# EAGLE design i2c-infrared-proximity-sensor-double-sided (EAGLE 5.11)
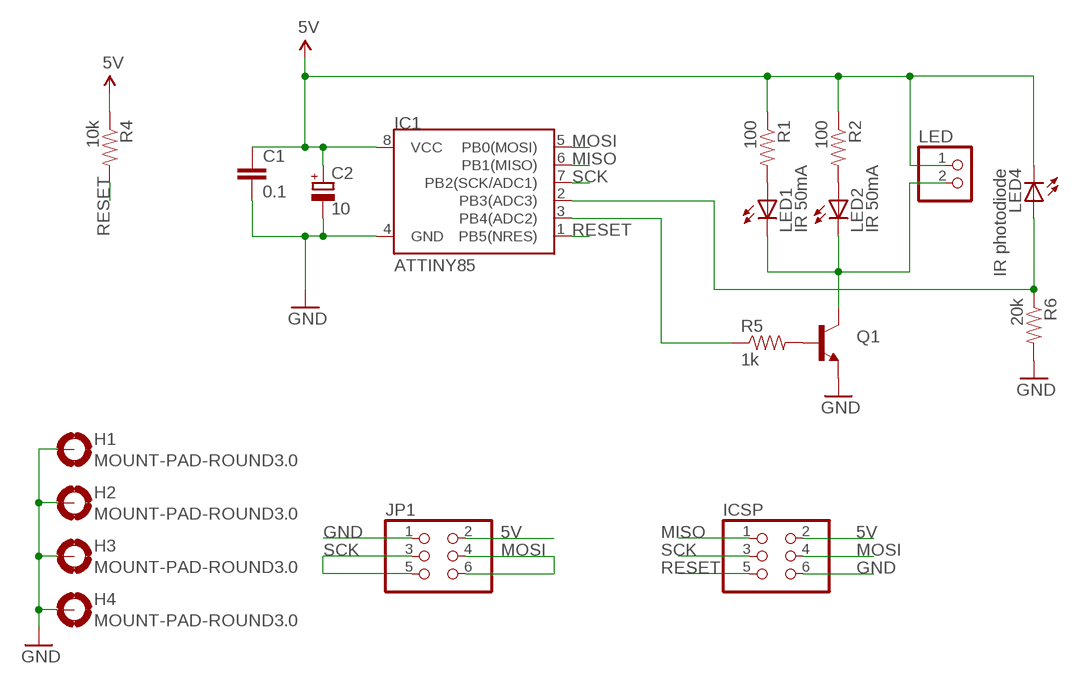
[diagram p0: schematic, sheet 1]

## Parts
C1  0.1  C-EUC0805  [C0805]
C2  10  CPOL-EUSMCA  [SMC_A]
H1  MOUNT-PAD-ROUND3.0  [3,0-PAD]
H2  MOUNT-PAD-ROUND3.0  [3,0-PAD]
H3  MOUNT-PAD-ROUND3.0  [3,0-PAD]
H4  MOUNT-PAD-ROUND3.0  [3,0-PAD]
IC1  ATTINY85  ATTINY45  [SO08-EIAJ]
ICSP  PINHD-2X3  [2X03]
JP1  PINHD-2X3/90  [2X03/90]
LED  PINHD-1X2  [1X02]
LED1  IR 50mA  LED5MM  [LED5MM]
LED2  IR 50mA  LED5MM  [LED5MM]
LED4  IR photodiode  LED5MM  [LED5MM]
Q1  TRANSISTOR_NPNSOT23  [SOT23]
R1  100  RESISTOR0805-RES  [0805]
R2  100  RESISTOR0805-RES  [0805]
R4  10k  RESISTOR0805-RES  [0805]
R5  1k  RESISTOR0805-RES  [0805]
R6  20k  RESISTOR0805-RES  [0805]

## Nets
5V: C1.1 C2.+ IC1.8(VCC) ICSP.2 JP1.2 LED4.K(C) LED.1 R1.1 R2.1 R4.1
GND: C1.2 C2.- H1.B3,0(MOUNT) H2.B3,0(MOUNT) H3.B3,0(MOUNT) H4.B3,0(MOUNT) IC1.4(GND) ICSP.6 JP1.1 Q1.2(E) R6.2
MISO: IC1.6(PB1(MISO)) ICSP.1
MOSI: IC1.5(PB0(MOSI)) ICSP.4 JP1.4 JP1.6
N$1: Q1.1(B) R5.2
N$2: LED1.A R1.2
N$3: LED2.A R2.2
N$5: LED1.K(C) LED2.K(C) LED.2 Q1.3(C)
N$6: IC1.3(PB4(ADC2)) R5.1
N$8: IC1.2(PB3(ADC3)) LED4.A R6.1
RESET: IC1.1(PB5(NRES)) ICSP.5 R4.2
SCK: IC1.7(PB2(SCK/ADC1)) ICSP.3 JP1.3 JP1.5

## Library data of the parts
C1 = rcl:C-EU: CAPACITOR, European symbol
C2 = rcl:CPOL-EU: POLARIZED CAPACITOR, European symbol
H1-H4 = holes:MOUNT-PAD-ROUND: MOUNTING PAD, round
IC1 = SparkFun:ATTINY45: Atmel ATTiny45
ICSP = SparkFun:PINHD-2X3: PIN HEADER
JP1 = pinhead:PINHD-2X3: PIN HEADER
LED = pinhead:PINHD-1X2: PIN HEADER
LED1 LED2 = SparkFun:LED: LEDs Standard schematic elements and footprints for 5mm, 3mm, 1206, and 0603 sized LEDs. 5mm - Spark Fun Electronics SKU : COM-00529 (and others)
LED4 = led:LED: LED OSRAM: - CHIPLED LG R971, LG N971, LY N971, LG Q971, LY Q971, LO R971, LY R971 LH N974, LH R974 LS Q976, LO Q976, LY Q976 LO Q996 - Hyper CHIPLED LW Q18S LB Q993, LB Q99A, LB R99A - SideLED LS A670, LO A670, LY A670, LG A670, LP A670 LB A673, LV A673, LT A673, LW A673 LH A674 LY A675 LS A676, LA A676, LO A676, LY A676, LW A676 LS A679, LY A679, LG A679 - Hyper Micro SIDELED® LS Y876, LA Y876, LO Y876, LY Y876 LT Y87S - SmartLED LW L88C, LW L88S LB L89C, LB L89S, LG L890 LS L89K, LO L89K, LY L89K LS L896, LA L896, LO L896, LY L896 - TOPLED LS T670, LO T670, LY T670, LG T670, LP T670 LSG T670, LSP T670, LSY T670, LOP T670, LYG T670 LG T671, LOG T671, LSG T671 LB T673, LV T673, LT T673, LW T673 LH T674 LS T676, LA T676, LO T676, LY T676, LB T676, LH T676, LSB T676, LW T676 LB T67C, LV T67C, LT T67C, LS T67K, LO T67K, LY T67K, LW E67C LS E67B, LA E67B, LO E67B, LY E67B, LB E67C, LV E67C, LT E67C LW T67C LS T679, LY T679, LG T679 LS T770, LO T770, LY T770, LG T770, LP T770 LB T773, LV T773, LT T773, LW T773 LH T774 LS E675, LA E675, LY E675, LS T675 LS T776, LA T776, LO T776, LY T776, LB T776 LHGB T686 LT T68C, LB T68C - Hyper Mini TOPLED® LB M676 - Mini TOPLED Santana® LG M470 LS M47K, LO M47K, LY M47K Source: http://www.osram.convergy.de LUXEON: - LUMILED® LXK2-PW12-R00, LXK2-PW12-S00, LXK2-PW14-U00, LXK2-PW14-V00 LXK2-PM12-R00, LXK2-PM12-S00, LXK2-PM14-U00 LXK2-PE12-Q00, LXK2-PE12-R00, LXK2-PE12-S00, LXK2-PE14-T00, LXK2-PE14-U00 LXK2-PB12-K00, LXK2-PB12-L00, LXK2-PB12-M00, LXK2-PB14-N00, LXK2-PB14-P00, LXK2-PB14-Q00 LXK2-PR12-L00, LXK2-PR12-M00, LXK2-PR14-Q00, LXK2-PR14-R00 LXK2-PD12-Q00, LXK2-PD12-R00, LXK2-PD12-S00 LXK2-PH12-R00, LXK2-PH12-S00 LXK2-PL12-P00, LXK2-PL12-Q00, LXK2-PL12-R00 Source: www.luxeon.com KINGBRIGHT: KA-3528ASYC Source: www.kingbright.com
Q1 = SparkFun:TRANSISTOR_NPN: Transistor NPN BJT configuration in SOT23 package. MMBT2222 is the common NPN we use. Double check BCE configuration again layout.
R1 R2 R4-R6 = SparkFun:RESISTOR: Resistor Basic schematic elements and footprints for 0603, 1206, and PTH resistors.

## Board
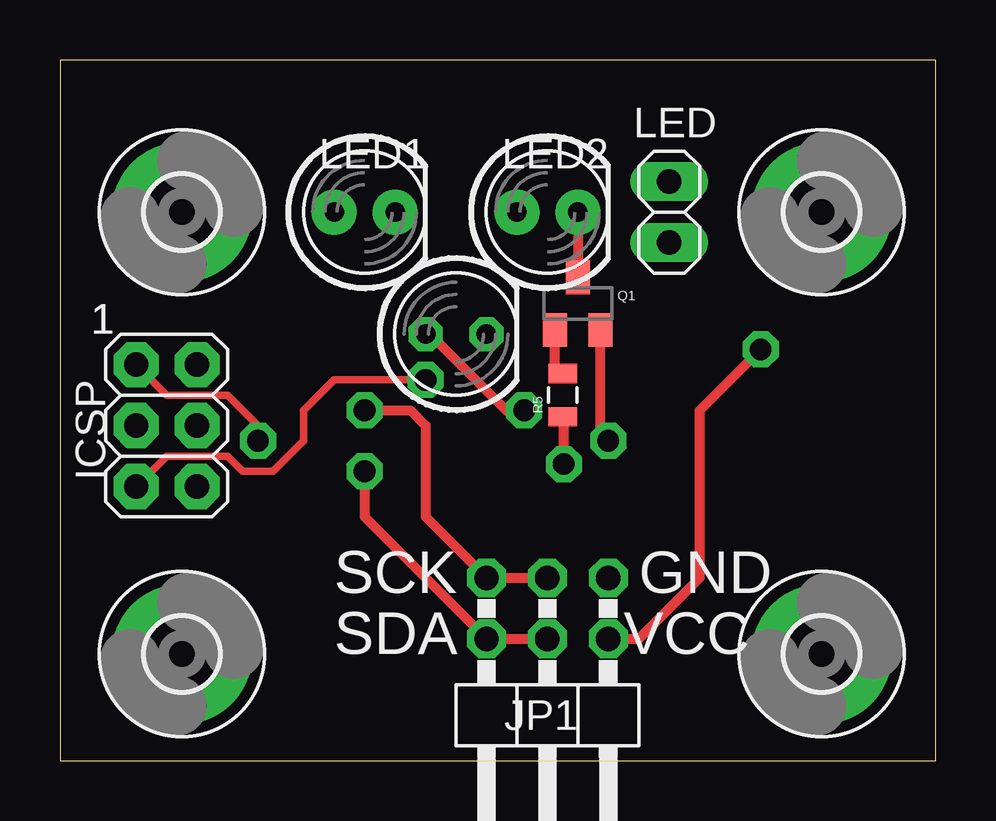
[diagram p1: board, top side]
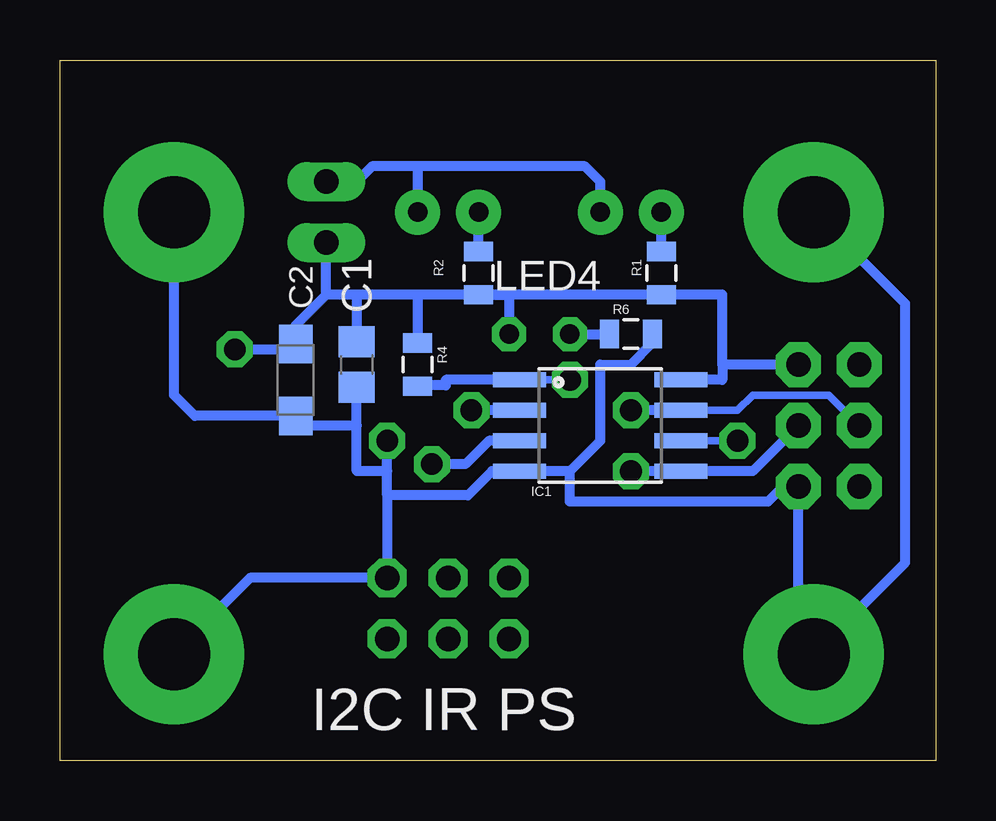
[diagram p2: board, bottom side, seen from below]

Size 36.5 x 29.2 mm. Coordinates in mm from the lower left corner, seen from the top.
Outline: 0,0 36.5,0 36.5,29.2 0,29.2 0,0
Copper layers (1*16): Top 0.035mm / dielectric 1.5mm / Bottom 0.035mm
Design rules "default *": minimum track width 0.3mm, minimum drill 0.9mm, track to track 0.3mm, track to pad 0.3mm, pad to pad 0.3mm, via to via 0.3mm, smd to smd 0.3mm, copper to edge 40mil, drill to drill 8mil, minimum pad ring 0.3mm, minimum via ring 0.3mm, stop-mask expansion 4mil, vias tented up to drill 0mil, thermal gap 10mil

### Footprints (pad centres in the part's own frame; a part is rotated, then mirrored left to right if it is on the bottom)
C0805 = smd 1.3 x 1.5: 1 -0.95,0; 2 0.95,0
SMC_A = smd 1.6 x 1.4: + -1.5,0; - 1.5,0
3,0-PAD = drill 3 pad 5.842 round: B3,0 0,0
SO08-EIAJ = smd 0.61 x 2.21: 1 -1.905,-3.378; 2 -0.635,-3.378; 3 0.635,-3.378; 4 1.905,-3.378; 5 1.905,3.353; 6 0.635,3.353; 7 -0.635,3.353; 8 -1.905,3.353
2X03 = drill 1.016 pad 1.88 octagon: 1 -2.54,-1.27; 2 -2.54,1.27; 3 0,-1.27; 4 0,1.27; 5 2.54,-1.27; 6 2.54,1.27
2X03/90 = drill 1.016 octagon: 1 -2.54,-6.35; 2 -2.54,-3.81; 3 0,-6.35; 4 0,-3.81; 5 2.54,-6.35; 6 2.54,-3.81
1X02 = drill 1.016 long: 1 -1.27,0; 2 1.27,0
LED5MM = drill 0.813 pad 1.88 round: A -1.27,0; K 1.27,0
LED5MM' = drill 0.813 octagon: A -1.27,0; K 1.27,0
SOT23 = smd 1 x 1.4: 1 -0.95,-1.1; 2 0.95,-1.1; 3 0,1.1
0805 = smd 0.8 x 1.2: 1 -0.9,0; 2 0.9,0

### Placement (x,y rotation side)
C1  24.13,16.51 270 bottom
C2  26.67,15.87 270 bottom
H1  31.75,4.44 0 top
H2  31.75,22.86 0 top
H3  5.08,22.86 0 top
H4  5.08,4.44 0 top
IC1  13.97,13.97 270 bottom
ICSP  4.45,13.97 270 top
JP1  20.32,1.27 180 top
LED  25.4,22.86 90 top
LED1  12.7,22.86 0 top
LED2  20.32,22.86 0 top
LED4  IR photodiode  [LED5MM']  16.51,17.78 0 top
Q1  21.59,19.05 0 top
R1  11.43,20.32 90 bottom
R2  19.05,20.32 90 bottom
R4  21.59,16.51 270 bottom
R5  20.95,15.24 90 top
R6  12.7,17.78 0 bottom

### Tracks (layer width: path | path; a pad name or v marks a point on that pad's centre or on a via)
5V  (via drill 0.9)
  Top 0.406: JP1.2 24.13,5.08 26.67,7.62 26.67,14.61 v29.21,17.14
  Bottom 0.406: R2.1 R1.1 8.89,19.42 8.89,16.51 | R2.1 21.59,19.42 | 21.59,19.42 24.13,19.42 | 24.13,19.42 25.4,19.42 | 25.4,19.42 LED.1 | R2.1 17.78,19.42 LED4.K | 21.59,19.42 R4.1 | ICSP.2 8.89,16.51 | 8.89,16.51 8.89,15.87 IC1.8 | 24.13,19.42 C1.1 | 25.4,19.42 26.67,18.15 C2.+ 26.9,17.14 v29.21,17.14
GND  (via drill 0.9)
  Top 0.406: Q1.2 22.54,13.65 v22.86,13.33
  Bottom 0.406: 24.13,13.97 C1.2 | 24.13,13.97 26.27,13.97 C2.- 30.89,14.37 31.75,15.24 H2.B3,0 | 22.86,12.07 24.13,12.07 24.13,13.97 | H1.B3,0 28.57,7.62 JP1.1 22.86,11.06 | 22.86,11.06 22.86,12.07 | 15.24,12.07 15.24,10.79 6.99,10.79 6.35,11.43 ICSP.6 5.71,5.08 H4.B3,0 1.27,8.25 1.27,19.05 H3.B3,0 | 15.24,12.07 IC1.4 18.5,12.07 19.5,11.06 22.86,11.06 | R6.2 11.8,17.41 12.7,16.51 13.97,16.51 13.97,13.33 15.24,12.07 | 22.86,12.07 v22.86,13.33
MISO  (via drill 0.9)
  Top 0.305: ICSP.1 4.45,15.24 6.99,15.24 8.26,13.97 v8.26,13.33
  Bottom 0.305: v8.26,13.33 IC1.6
MOSI  (via drill 0.9)
  Top 0.406: v12.7,12.07 12.7,10.16 JP1.6 JP1.4
  Bottom 0.406: ICSP.4 7.62,12.07 IC1.5 v12.7,12.07
N$1
  Top 0.406: R5.2 20.64,16.14 Q1.1
N$2
  Bottom 0.406: R1.2 LED1.A
N$3
  Bottom 0.406: R2.2 LED2.A
N$5
  Top 0.406: LED2.K Q1.3
  Bottom 0.406: LED1.K 13.97,24.13 14.61,24.76 21.59,24.76 | 21.59,24.76 23.5,24.76 24.13,24.13 LED.2 | 21.59,24.76 LED2.K
N$6  (via drill 0.9)
  Top 0.406: v21,12.36 21,14.29 R5.1
  Bottom 0.406: IC1.3 18.62,13.33 19.6,12.36 v21,12.36
N$8  (via drill 0.9)
  Top 0.406: LED4.A 15.43,17.78 18.6,14.61 v19.35,14.61
  Bottom 0.406: LED4.A R6.1 | IC1.2 v19.35,14.61
RESET  (via drill 0.9)
  Top 0.305: ICSP.5 4.45,12.7 6.99,12.7 7.62,12.07 8.89,12.07 10.16,13.33 10.16,14.61 11.43,15.87 v15.24,15.87
  Bottom 0.305: v15.24,15.87 IC1.1
  Bottom 0.406: IC1.1 20.42,15.87 20.42,15.65 21.59,15.65 R4.2
SCK  (via drill 0.9)
  Top 0.406: v12.7,14.61 14.61,14.61 15.24,13.97 15.24,10.16 JP1.5 JP1.3
  Bottom 0.305: ICSP.3 4.45,15.24 7.62,15.24 8.26,14.61 IC1.7
  Bottom 0.406: IC1.7 v12.7,14.61

### Text on the board
tNames: 1 | 1 | SCK | GND | SDA | VCC
bNames: I2C IR PS